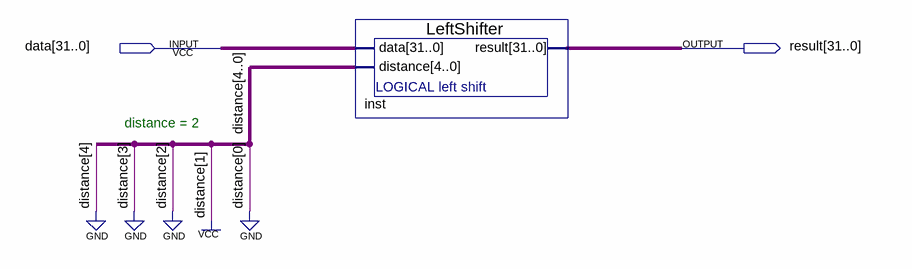
[diagram p0: schematic sheet]
// Quartus schematic Shift2BitsLeft.bdf as structural Verilog: 1 symbols, 2 pins
module Shift2BitsLeft (
  input  [31:0] data,
  output [31:0] result
);

  LeftShifter inst (.data(data), .distance(5'b00010), .result(result));

  // Notes on the sheet:
  //   distance = 2
endmodule
